# EAGLE schematic clock (EAGLE 9.6.2)
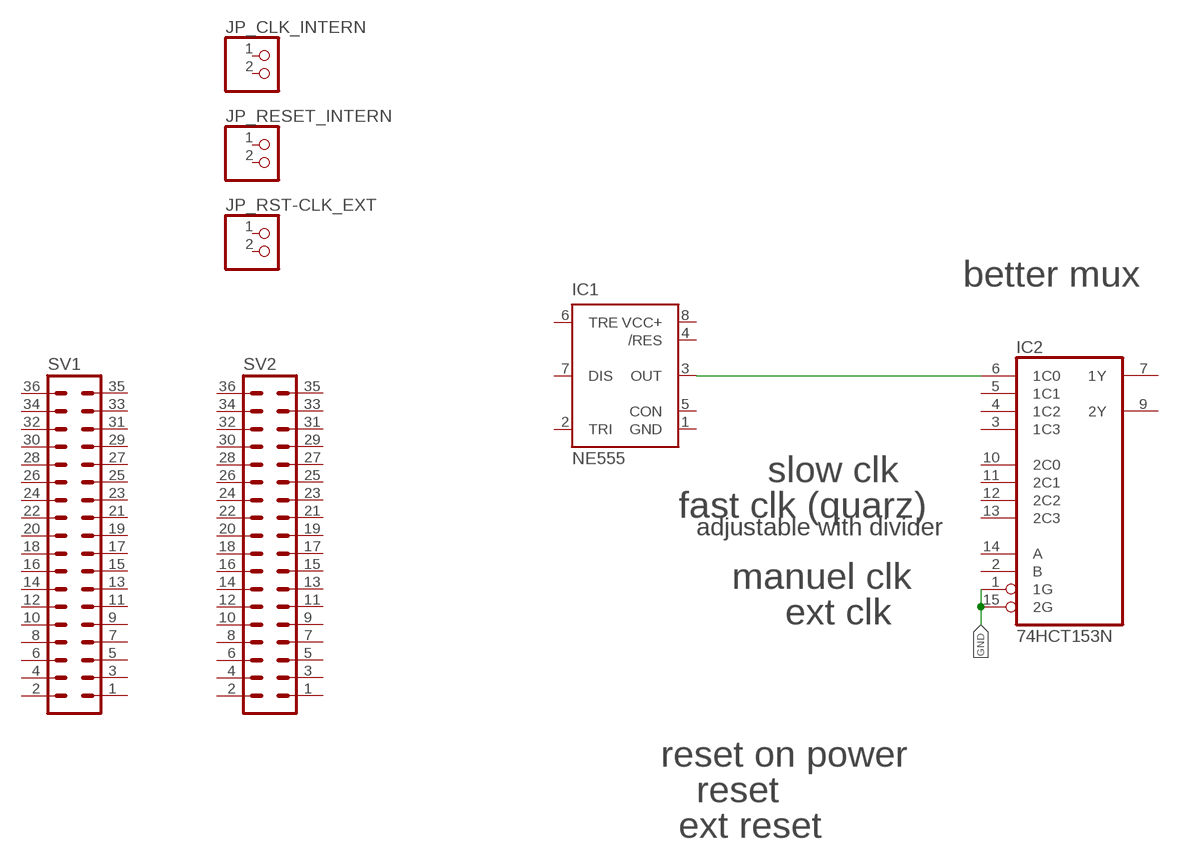
[diagram p0: schematic, sheet 1]

## Parts
IC1  NE555  [DIL-08]
IC2  74HCT153N  [DIL16]
JP_CLK_INTERN  PINHD-1X2  [1X02]
JP_RESET_INTERN  PINHD-1X2  [1X02]
JP_RST-CLK_EXT  PINHD-1X2  [1X02]
SV1  MA18-2  [MA18-2]
SV2  MA18-2  [MA18-2]

## Nets
GND: IC2.1(1G) IC2.15(2G)
N$1: IC1.3(OUT) IC2.6(1C0)
Unconnected: IC1.2(TRI) IC1.4(/RES) IC1.5(CON) IC1.6(TRE) IC1.7(DIS) IC2.2(B) IC2.3(1C3) IC2.4(1C2) IC2.5(1C1) IC2.7(1Y) IC2.9(2Y) IC2.10(2C0) IC2.11(2C1) IC2.12(2C2) IC2.13(2C3) IC2.14(A) JP_CLK_INTERN.1 JP_CLK_INTERN.2 JP_RESET_INTERN.1 JP_RESET_INTERN.2 JP_RST-CLK_EXT.1 JP_RST-CLK_EXT.2 SV1.1 SV1.2 SV1.3 SV1.4 SV1.5 SV1.6 SV1.7 SV1.8 SV1.9 SV1.10 SV1.11 SV1.12 SV1.13 SV1.14 SV1.15 SV1.16 SV1.17 SV1.18 SV1.19 SV1.20 SV1.21 SV1.22 SV1.23 SV1.24 SV1.25 SV1.26 SV1.27 SV1.28 SV1.29 SV1.30 SV1.31 SV1.32 SV1.33 SV1.34 SV1.35 SV1.36 SV2.1 SV2.2 SV2.3 SV2.4 SV2.5 SV2.6 SV2.7 SV2.8 SV2.9 SV2.10 SV2.11 SV2.12 SV2.13 SV2.14 SV2.15 SV2.16 SV2.17 SV2.18 SV2.19 SV2.20 SV2.21 SV2.22 SV2.23 SV2.24 SV2.25 SV2.26 SV2.27 SV2.28 SV2.29 SV2.30 SV2.31 SV2.32 SV2.33 SV2.34 SV2.35 SV2.36

## Notes on the sheet
- better mux
- slow clk
- fast clk (quarz)
- adjustable with divider
- manuel clk
- ext clk
- reset on power
- reset
- ext reset

## Power pins joined to a net without a drawn wire
GND: IC1.1(GND) IC2.8(GND)
VCC: IC2.16(VCC)
VCC+: IC1.8(VCC+)

## Library data of the parts
IC1 = st-microelectronics:NE555: General purpose bipolar Timer; MF: Arrow Electronics; MPN: NE555N; OC_FARNELL: 1467742; OC_NEWARK: 89K1486
IC2 = 74xx-eu:74*153: Dual 4-line to 1-line data SELECTOR/MULTIPLEXER
JP_CLK_INTERN JP_RESET_INTERN JP_RST-CLK_EXT = pinhead:PINHD-1X2: PIN HEADER
SV1 SV2 = con-lstb:MA18-2: PIN HEADER; OC_FARNELL: unknown; OC_NEWARK: unknown